# Altium schematic sheet FPGA6.SchDoc: FPGA-6
size A; Revision: 04
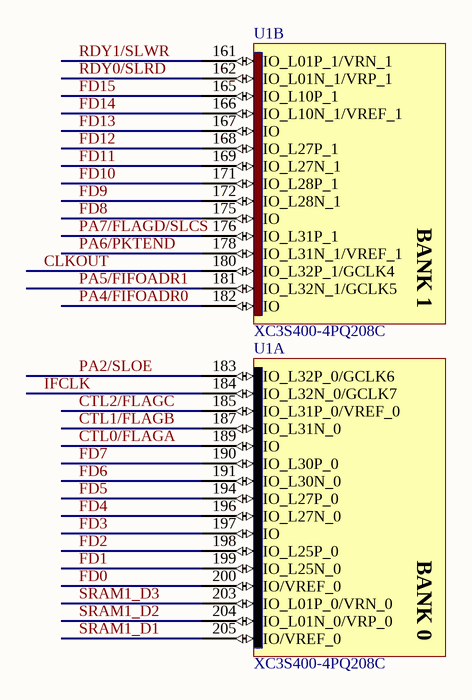
[diagram p0: FPGA6.SchDoc]

## Parts
U1  XC3S400-4PQ208C  [PQ208_N]  (parts A,B of 11)

## Nets
CLKOUT: U1.180(IO_L32P_1/GCLK4)
CTL0/FLAGA: U1.189(IO)
CTL1/FLAGB: U1.187(IO_L31N_0)
CTL2/FLAGC: U1.185(IO_L31P_0/VREF_0)
FD0: U1.200(IO/VREF_0)
FD1: U1.199(IO_L25N_0)
FD2: U1.198(IO_L25P_0)
FD3: U1.197(IO)
FD4: U1.196(IO_L27N_0)
FD5: U1.194(IO_L27P_0)
FD6: U1.191(IO_L30N_0)
FD7: U1.190(IO_L30P_0)
FD8: U1.175(IO)
FD9: U1.172(IO_L28N_1)
FD10: U1.171(IO_L28P_1)
FD11: U1.169(IO_L27N_1)
FD12: U1.168(IO_L27P_1)
FD13: U1.167(IO)
FD14: U1.166(IO_L10N_1/VREF_1)
FD15: U1.165(IO_L10P_1)
IFCLK: U1.184(IO_L32N_0/GCLK7)
PA2/SLOE: U1.183(IO_L32P_0/GCLK6)
PA4/FIFOADR0: U1.182(IO)
PA5/FIFOADR1: U1.181(IO_L32N_1/GCLK5)
PA6/PKTEND: U1.178(IO_L31N_1/VREF_1)
PA7/FLAGD/SLCS: U1.176(IO_L31P_1)
RDY0/SLRD: U1.162(IO_L01N_1/VRP_1)
RDY1/SLWR: U1.161(IO_L01P_1/VRN_1)
SRAM1_D1: U1.205(IO/VREF_0)
SRAM1_D2: U1.204(IO_L01N_0/VRP_0)
SRAM1_D3: U1.203(IO_L01P_0/VRN_0)

## Notes on the sheet
- Engineer:
- Title:
- Saleh Jamali
- Revision:
- (in symbol XC3S400-4PQ208C, part A) BANK 0
- (in symbol XC3S400-4PQ208C, part B) BANK 1

## Library data of the parts
U1 = XC3S400-4PQ208C: Spartan-3 1.2V FPGA, 141 User I/Os, 208-Pin PQFP, Standard Performance, Commercial Grade; OrderingInformation: Additional code may have to be appended for different mask revision devices.; DatasheetVersion: ver2.5, Dec-2009; PackageVersion: ver1.2, Jun-2004; PackageReference: PQ208; PackageDescription: 208-Pin Plastic Quad Flat Pack (PQ208); Code_JEDEC: MS-029-FA-1; ComponentLink1Description: Manufacturer URL; ComponentLink1URL: http://www.xilinx.com/; ComponentLink2Description: Spartan-3 Datasheet; ComponentLink2URL: http://www.xilinx.com/support/documentation/data_sheets/ds099.pdf; ComponentLink3Description: PQ208 Package Drawing; ComponentLink3URL: http://www.xilinx.com/support/documentation/package_specs/pq208.pdf; ComponentLink4Description: Spartan-3 Documents; ComponentLink4URL: http://www.xilinx.com/support/documentation/spartan-3.htm